# EAGLE design Yantronix_ECG_Pre_Alpha (EAGLE 5.10)
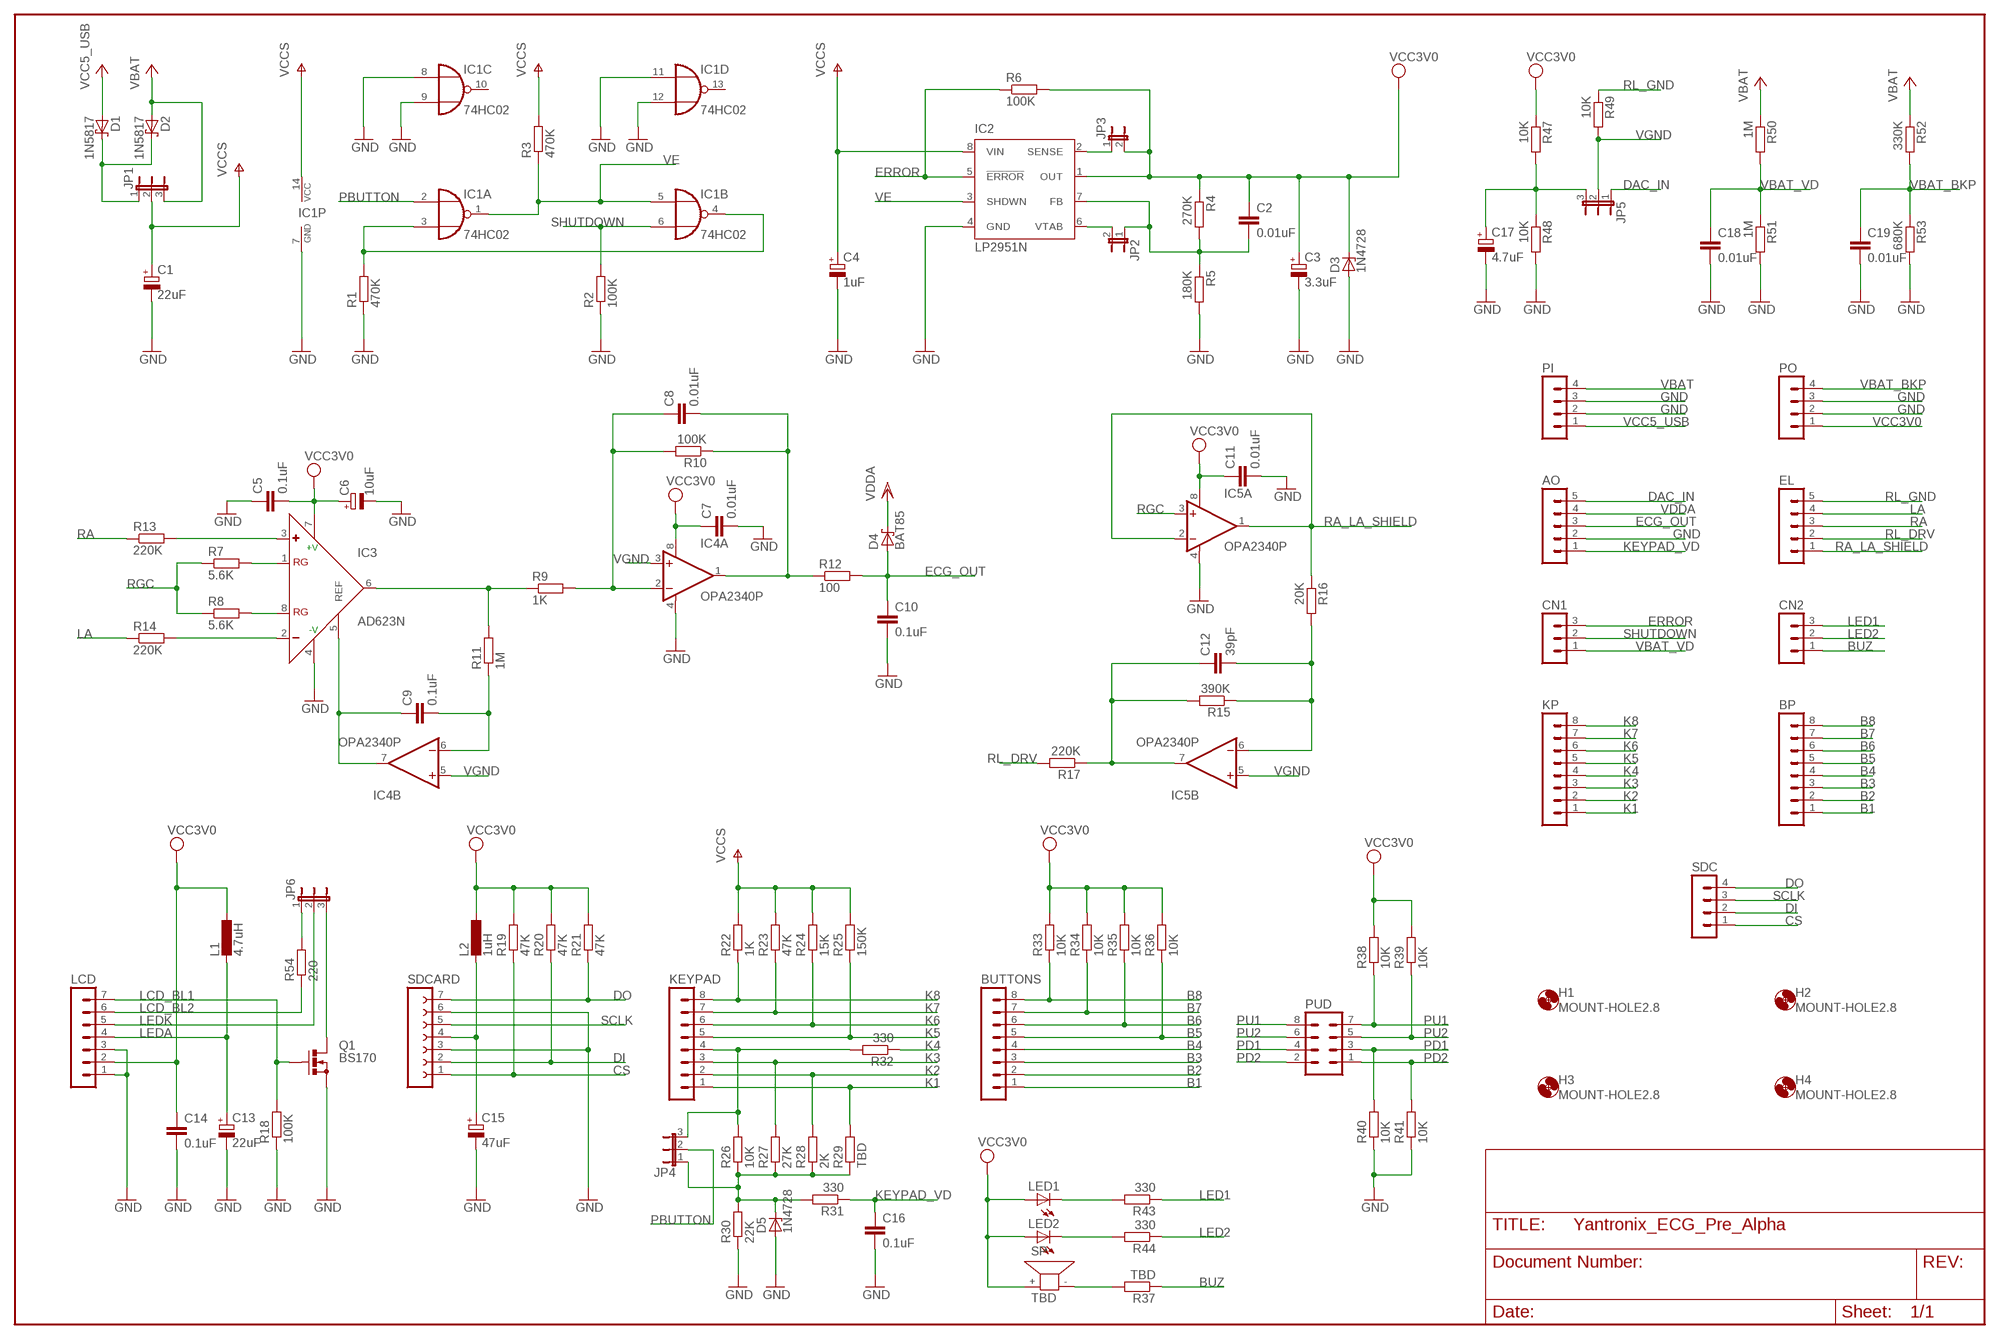
[diagram p0: schematic, sheet 1]

## Parts
AO  MA05-1  [MA05-1]
BP  MA08-1  [MA08-1]
BUTTONS  MA08-1  [MA08-1]
C1  22uF  CPOL-EUE2.5-5  [E2,5-5]
C2  0.01uF  C-EU050-025X075  [C050-025X075]
C3  3.3uF  CPOL-EUE2.5-5  [E2,5-5]
C4  1uF  CPOL-EUE2.5-5  [E2,5-5]
C5  0.1uF  C-EU050-025X075  [C050-025X075]
C6  10uF  CPOL-EUE2.5-5  [E2,5-5]
C7  0.01uF  C-EU050-025X075  [C050-025X075]
C8  0.01uF  C-EU050-025X075  [C050-025X075]
C9  0.1uF  C-EU050-025X075  [C050-025X075]
C10  0.1uF  C-EU050-025X075  [C050-025X075]
C11  0.01uF  C-EU050-025X075  [C050-025X075]
C12  39pF  C-EU050-025X075  [C050-025X075]
C13  22uF  CPOL-EUE2.5-5  [E2,5-5]
C14  0.1uF  C-EU050-025X075  [C050-025X075]
C15  47uF  CPOL-EUE2.5-5  [E2,5-5]
C16  0.1uF  C-EU050-025X075  [C050-025X075]
C17  4.7uF  CPOL-EUE2.5-5  [E2,5-5]
C18  0.01uF  C-EU050-025X075  [C050-025X075]
C19  0.01uF  C-EU050-025X075  [C050-025X075]
CN1  MA03-1  [MA03-1]
CN2  MA03-1  [MA03-1]
D1  1N5817  1N5817-B  [DO41-7.6]
D2  1N5817  1N5817-B  [DO41-7.6]
D3  1N4728  [DO41Z10]
D4  BAT85  SCHOTTKY-DIODEDO35-7  [DO35-7]
D5  1N4728  [DO41Z10]
EL  MA05-1  [MA05-1]
H1  MOUNT-HOLE2.8  [2,8]
H2  MOUNT-HOLE2.8  [2,8]
H3  MOUNT-HOLE2.8  [2,8]
H4  MOUNT-HOLE2.8  [2,8]
IC1  74HC02  74HC02N  [DIL14]
IC2  LP2951N  [DIL08]
IC3  AD623N  [DIL08]
IC4  OPA2340P  [DIL08]
IC5  OPA2340P  [DIL08]
JP1  JP2E  [JP2]
JP2  JP1E  [JP1]
JP3  JP1E  [JP1]
JP4  JP2E  [JP2]
JP5  JP2E  [JP2]
JP6  JP2E  [JP2]
KEYPAD  MA08-1  [MA08-1]
KP  MA08-1  [MA08-1]
L1  4.7uH  L-EU2200-15.24  [2200-15.24]
L2  1uH  L-EU2200-15.24  [2200-15.24]
LCD  MA07-1  [MA07-1]
LED1  LED3MM  [LED3MM]
LED2  LED3MM  [LED3MM]
PI  MA04-1  [MA04-1]
PO  MA04-1  [MA04-1]
PUD  MA04-2  [MA04-2]
Q1  BS170  [SOT54E]
R1  470K  R-EU_0204/7  [0204/7]
R2  100K  R-EU_0204/7  [0204/7]
R3  470K  R-EU_0204/7  [0204/7]
R4  270K  R-EU_0204/7  [0204/7]
R5  180K  R-EU_0204/7  [0204/7]
R6  100K  R-EU_0204/7  [0204/7]
R7  5.6K  R-EU_0204/7  [0204/7]
R8  5.6K  R-EU_0204/7  [0204/7]
R9  1K  R-EU_0204/7  [0204/7]
R10  100K  R-EU_0204/7  [0204/7]
R11  1M  R-EU_0204/7  [0204/7]
R12  100  R-EU_0204/7  [0204/7]
R13  220K  R-EU_0204/7  [0204/7]
R14  220K  R-EU_0204/7  [0204/7]
R15  390K  R-EU_0204/7  [0204/7]
R16  20K  R-EU_0204/7  [0204/7]
R17  220K  R-EU_0204/7  [0204/7]
R18  100K  R-EU_0204/7  [0204/7]
R19  47K  R-EU_0204/7  [0204/7]
R20  47K  R-EU_0204/7  [0204/7]
R21  47K  R-EU_0204/7  [0204/7]
R22  1K  R-EU_0204/7  [0204/7]
R23  47K  R-EU_0204/7  [0204/7]
R24  15K  R-EU_0204/7  [0204/7]
R25  150K  R-EU_0204/7  [0204/7]
R26  10K  R-EU_0204/7  [0204/7]
R27  27K  R-EU_0204/7  [0204/7]
R28  2K  R-EU_0204/7  [0204/7]
R29  TBD  R-EU_0204/7  [0204/7]
R30  22K  R-EU_0204/7  [0204/7]
R31  330  R-EU_0204/7  [0204/7]
R32  330  R-EU_0204/7  [0204/7]
R33  10K  R-EU_0204/7  [0204/7]
R34  10K  R-EU_0204/7  [0204/7]
R35  10K  R-EU_0204/7  [0204/7]
R36  10K  R-EU_0204/7  [0204/7]
R37  TBD  R-EU_0204/7  [0204/7]
R38  10K  R-EU_0204/7  [0204/7]
R39  10K  R-EU_0204/7  [0204/7]
R40  10K  R-EU_0204/7  [0204/7]
R41  10K  R-EU_0204/7  [0204/7]
R43  330  R-EU_0204/7  [0204/7]
R44  330  R-EU_0204/7  [0204/7]
R47  10K  R-EU_0204/7  [0204/7]
R48  10K  R-EU_0204/7  [0204/7]
R49  10K  R-EU_0204/7  [0204/7]
R50  1M  R-EU_0204/7  [0204/7]
R51  1M  R-EU_0204/7  [0204/7]
R52  330K  R-EU_0204/7  [0204/7]
R53  680K  R-EU_0204/7  [0204/7]
R54  220  R-EU_0204/7  [0204/7]
SDC  MA04-1  [MA04-1]
SDCARD  FE07W  [FE07W]
SP  TBD  KSS1201  [KSS1201]

## Nets
B1: BP.1 BUTTONS.1
B2: BP.2 BUTTONS.2
B3: BP.3 BUTTONS.3
B4: BP.4 BUTTONS.4
B5: BP.5 BUTTONS.5 R36.1
B6: BP.6 BUTTONS.6 R35.1
B7: BP.7 BUTTONS.7 R34.1
B8: BP.8 BUTTONS.8 R33.1
BUZ: CN2.1 R37.1
CS: R19.1 SDC.1 SDCARD.1
DAC_IN: AO.5 JP5.1
DI: R20.1 SDC.2 SDCARD.2
DO: R21.1 SDC.4 SDCARD.7
ECG_OUT: AO.3 C10.1 D4.A R12.2
ERROR: CN1.3 IC2.5(!ERROR) R6.1
GND: AO.2 C1.- C3.- C4.- C5.1 C6.- C7.2 C10.2 C11.2 C13.- C14.2 C15.- C16.2 C17.- C18.2 C19.2 D3.A D5.A IC1.7(P:GND) IC1.8(C:I0) IC1.9(C:I1) IC1.11(D:I0) IC1.12(D:I1) IC2.4(GND) IC3.4(-V) IC4.4(A:V-) IC5.4(A:V-) LCD.1 LCD.3 PI.2 PI.3 PO.2 PO.3 Q1.S R1.1 R2.1 R5.2 R18.1 R30.1 R40.1 R41.1 R48.2 R51.2 R53.2 SDCARD.3 SDCARD.6
K1: KEYPAD.1 KP.1 R29.2
K2: KEYPAD.2 KP.2 R28.2
K3: KEYPAD.3 KP.3 R27.2
K4: KP.4 R32.1
K5: KEYPAD.5 KP.5 R25.1
K6: KEYPAD.6 KP.6 R24.1
K7: KEYPAD.7 KP.7 R23.1
K8: KEYPAD.8 KP.8 R22.1
KEYPAD_VD: AO.1 C16.1 R31.1
LA: EL.4 R14.1
LCD_BL1: LCD.7 Q1.G R18.2
LCD_BL2: LCD.6 R54.1
LED1: CN2.3 R43.1
LED2: CN2.2 R44.1
LEDA: C13.+ L1.2 LCD.4
LEDK: JP6.2 LCD.5
N$1: D1.C D2.C JP1.1
N$3: IC1.3(A:I1) IC1.4(B:O) R1.2
N$4: IC2.6(VTAB) JP2.2
N$5: C2.2 IC2.7(FB) JP2.1 R4.2 R5.1
N$6: IC2.2(SENSE) JP3.1
N$7: IC3.1(RG) R7.2
N$8: IC3.8(RG) R8.2
N$9: C12.2 IC5.6(B:-IN) R15.1 R16.2
N$10: IC3.6(OUT) R9.1 R11.2
N$11: C8.1 IC4.2(A:-IN) R9.2 R10.2
N$12: C8.2 IC4.1(A:OUT) R10.1 R12.1
N$13: C12.1 IC5.7(B:OUT) R15.2 R17.1
N$14: C9.2 IC4.6(B:-IN) R11.1
N$15: C9.1 IC3.5(REF) IC4.7(B:OUT)
N$16: LED1.K(C) R43.2
N$17: IC3.3(+) R13.2
N$18: IC3.2(-) R14.2
N$19: LED2.K(C) R44.2
N$20: R37.2 SP.-
N$21: C15.+ L2.2 SDCARD.4
N$24: C17.+ JP5.3 R47.2 R48.1
N$27: JP4.3 KEYPAD.4 R26.2 R32.2
N$28: D5.C JP4.1 R26.1 R27.1 R28.1 R29.1 R30.2 R31.2
N$29: JP6.3 Q1.D
N$32: JP6.1 R54.2
PBUTTON: IC1.2(A:I0) JP4.2
PD1: PUD.3 PUD.4 R40.2
PD2: PUD.1 PUD.2 R41.2
PU1: PUD.7 PUD.8 R38.1
PU2: PUD.5 PUD.6 R39.1
RA: EL.3 R13.1
RA_LA_SHIELD: EL.1 IC5.1(A:OUT) IC5.2(A:-IN) R16.1
RGC: IC5.3(A:+IN) R7.1 R8.1
RL_DRV: EL.2 R17.2
RL_GND: EL.5 R49.1
SCLK: SDC.3 SDCARD.5
SHUTDOWN: CN1.2 IC1.6(B:I1) R2.2
VBAT [supply]: D2.A JP1.3 PI.4 R50.1 R52.1
VBAT_BKP: C19.1 PO.4 R52.2 R53.1
VBAT_VD: C18.1 CN1.1 R50.2 R51.1
VCC3V0 [supply]: C2.1 C3.+ C5.2 C6.+ C7.1 C11.1 C14.1 D3.C IC2.1(OUT) IC3.7(+V) IC4.8(A:V+) IC5.8(A:V+) JP3.2 L1.1 L2.1 LCD.2 LED1.A LED2.A PO.1 R4.1 R6.2 R19.2 R20.2 R21.2 R33.2 R34.2 R35.2 R36.2 R38.2 R39.2 R47.1 SP.+
VCC5_USB [supply]: D1.A PI.1
VCCS [supply]: C1.+ C4.+ IC1.14(P:VCC) IC2.8(VIN) JP1.2 R3.2 R22.2 R23.2 R24.2 R25.2
VDDA [supply]: AO.4 D4.C
VE: IC1.1(A:O) IC1.5(B:I0) IC2.3(SHDWN) R3.1
VGND: IC4.3(A:+IN) IC4.5(B:+IN) IC5.5(B:+IN) JP5.2 R49.2
Unconnected: IC1.10(C:O) IC1.13(D:O)

## Library data of the parts
AO EL = con-lstb:MA05-1: PIN HEADER
BP BUTTONS KEYPAD KP = con-lstb:MA08-1: PIN HEADER
C1 C3 C4 C6 C13 C15 C17 = rcl:CPOL-EU: POLARIZED CAPACITOR, European symbol
C2 C5 C7-C12 C14 C16 C18 C19 = rcl:C-EU: CAPACITOR, European symbol
CN1 CN2 = con-lstb:MA03-1: PIN HEADER
D1 D2 = diode:1N581*: 1.0A SCHOTTKY BARRIER RECTIFIER Source: http://www.diodes.com/datasheets/ds23001.pdf
D3 D5 = diode:1N4728: Z DIODE 3.3 V, 1W, 5 percent
D4 = diode:SCHOTTKY-DIODE: Schottky Diode
H1-H4 = holes:MOUNT-HOLE: MOUNTING HOLE with drill center marker
IC1 = 74xx-eu:74*02: Quad 2-input NOR gate
IC2 = national-semiconductor:LP2951: Adjustable Micropower Voltage Regulator Source: http://www.national.com/ds/LP/LP2950.pdf
IC3 = analog-devices:AD623: Single-Supply, Rail-to-Rail, Low Cost Instrumentation Amplifier Source: http://www.analog.com/static/imported-files/data_sheets/AD623.pdf
IC4 IC5 = burr-brown:OPA2340: Single-Supply, Rail-to-Rail Operational Amplifiers MicroAmplifier(TM) Series; Product Folder:OPA2340
JP1 JP4-JP6 = jumper:JP2E: JUMPER
JP2 JP3 = jumper:JP1E: JUMPER
L1 L2 = rcl:L-EU: INDUCTOR, European symbol
LCD = con-lstb:MA07-1: PIN HEADER
LED1 LED2 = led:LED: LED OSRAM: - CHIPLED LG R971, LG N971, LY N971, LG Q971, LY Q971, LO R971, LY R971 LH N974, LH R974 LS Q976, LO Q976, LY Q976 LO Q996 - Hyper CHIPLED LW Q18S LB Q993, LB Q99A, LB R99A - SideLED LS A670, LO A670, LY A670, LG A670, LP A670 LB A673, LV A673, LT A673, LW A673 LH A674 LY A675 LS A676, LA A676, LO A676, LY A676, LW A676 LS A679, LY A679, LG A679 - Hyper Micro SIDELED® LS Y876, LA Y876, LO Y876, LY Y876 LT Y87S - SmartLED LW L88C, LW L88S LB L89C, LB L89S, LG L890 LS L89K, LO L89K, LY L89K LS L896, LA L896, LO L896, LY L896 - TOPLED LS T670, LO T670, LY T670, LG T670, LP T670 LSG T670, LSP T670, LSY T670, LOP T670, LYG T670 LG T671, LOG T671, LSG T671 LB T673, LV T673, LT T673, LW T673 LH T674 LS T676, LA T676, LO T676, LY T676, LB T676, LH T676, LSB T676, LW T676 LB T67C, LV T67C, LT T67C, LS T67K, LO T67K, LY T67K, LW E67C LS E67B, LA E67B, LO E67B, LY E67B, LB E67C, LV E67C, LT E67C LW T67C LS T679, LY T679, LG T679 LS T770, LO T770, LY T770, LG T770, LP T770 LB T773, LV T773, LT T773, LW T773 LH T774 LS E675, LA E675, LY E675, LS T675 LS T776, LA T776, LO T776, LY T776, LB T776 LHGB T686 LT T68C, LB T68C - Hyper Mini TOPLED® LB M676 - Mini TOPLED Santana® LG M470 LS M47K, LO M47K, LY M47K Source: http://www.osram.convergy.de LUXEON: - LUMILED® LXK2-PW12-R00, LXK2-PW12-S00, LXK2-PW14-U00, LXK2-PW14-V00 LXK2-PM12-R00, LXK2-PM12-S00, LXK2-PM14-U00 LXK2-PE12-Q00, LXK2-PE12-R00, LXK2-PE12-S00, LXK2-PE14-T00, LXK2-PE14-U00 LXK2-PB12-K00, LXK2-PB12-L00, LXK2-PB12-M00, LXK2-PB14-N00, LXK2-PB14-P00, LXK2-PB14-Q00 LXK2-PR12-L00, LXK2-PR12-M00, LXK2-PR14-Q00, LXK2-PR14-R00 LXK2-PD12-Q00, LXK2-PD12-R00, LXK2-PD12-S00 LXK2-PH12-R00, LXK2-PH12-S00 LXK2-PL12-P00, LXK2-PL12-Q00, LXK2-PL12-R00 Source: www.luxeon.com KINGBRIGHT: KA-3528ASYC Source: www.kingbright.com
PI PO SDC = con-lstb:MA04-1: PIN HEADER
PUD = con-lstb:MA04-2: PIN HEADER
Q1 = transistor-small-signal:BS170: N-CHANNEL MOS FET
R1-R41 R43 R44 R47-R54 = rcl:R-EU_: RESISTOR, European symbol
SDCARD = con-lsta:FE07W: FEMALE HEADER
SP = buzzer:KSS1201: SPEAKER Source: Schukat

## Net classes
1 supply: width 1.27 mm

## Board
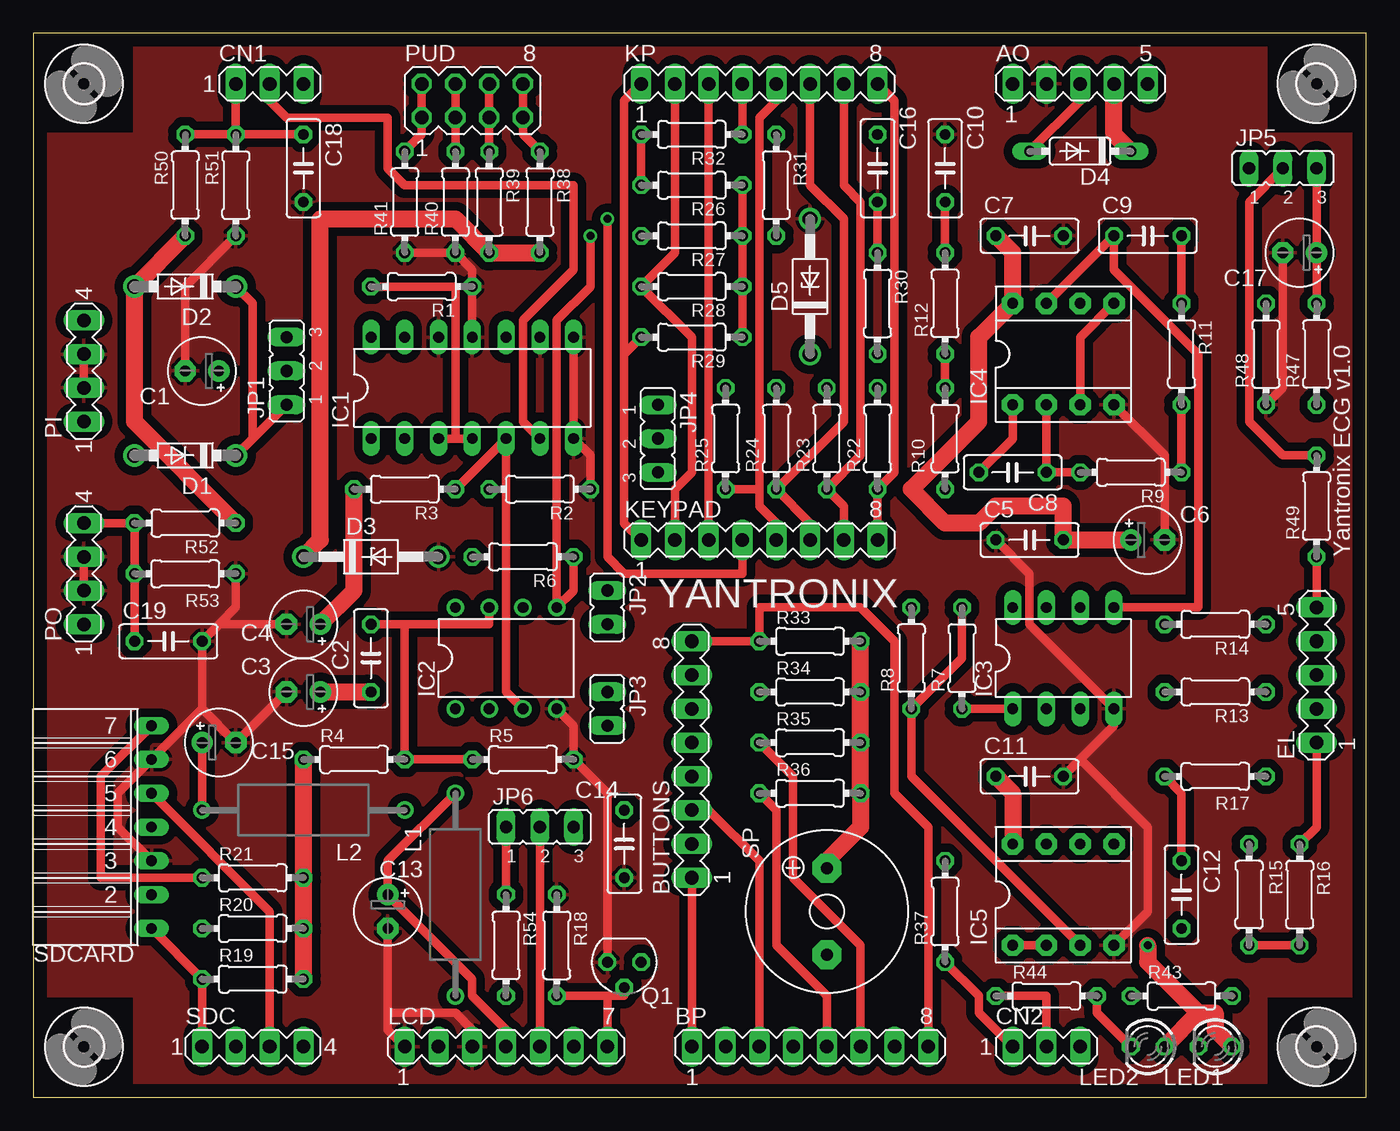
[diagram p1: board, top side]
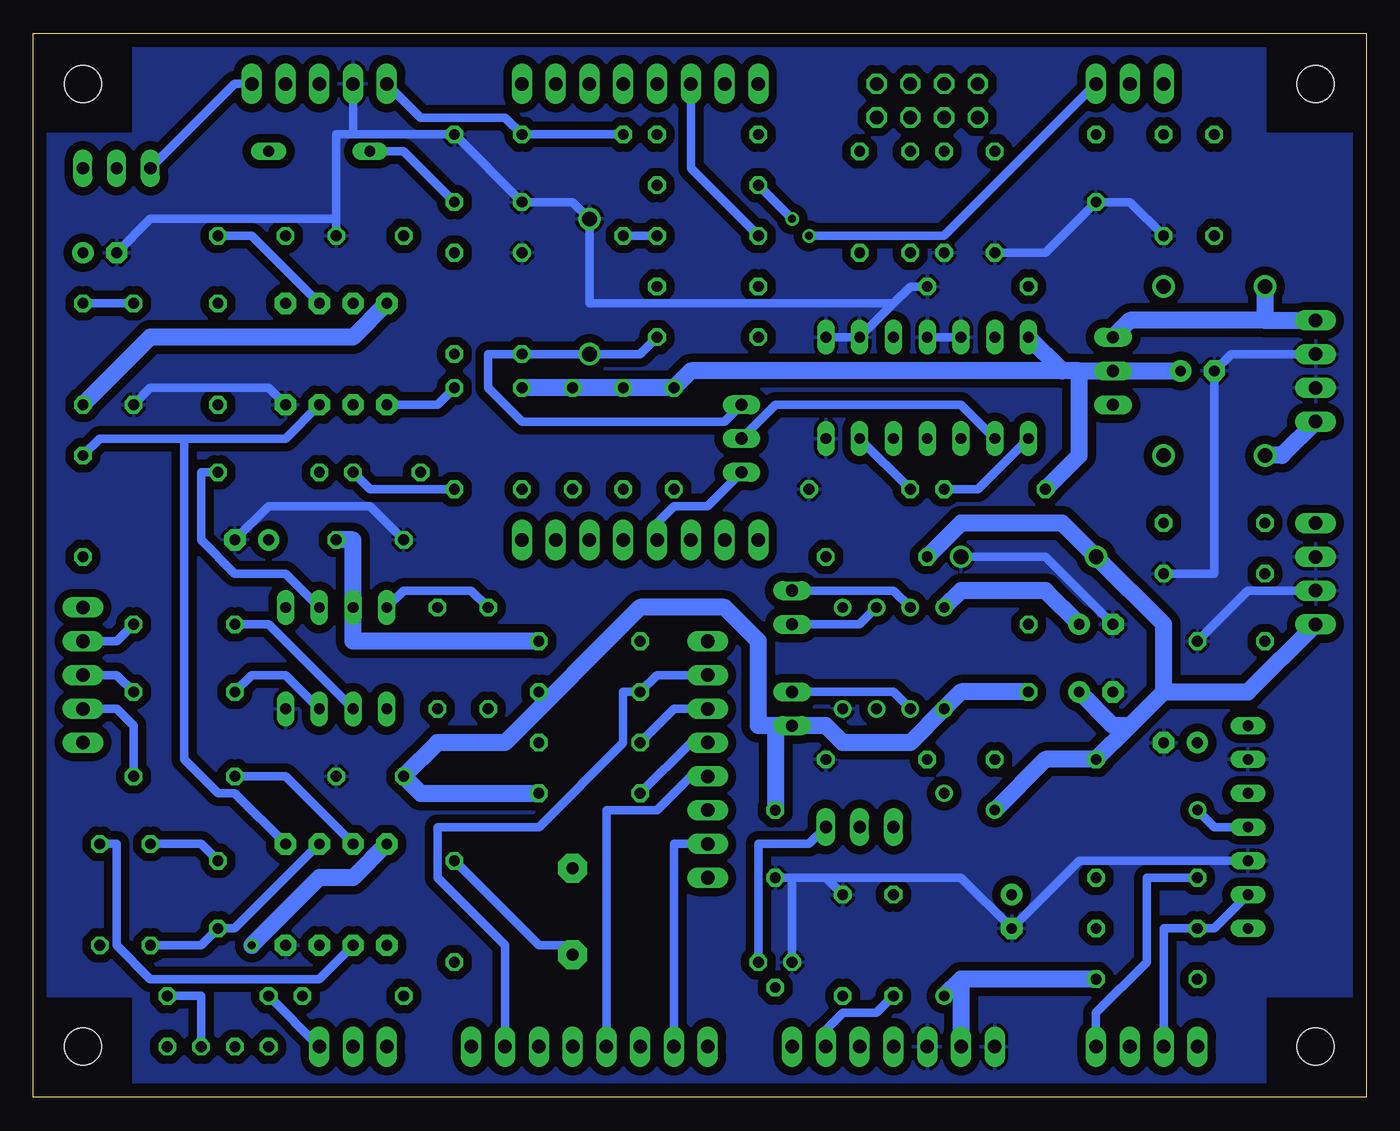
[diagram p2: board, bottom side, seen from below]

Size 100.25 x 80 mm. Coordinates in mm from the lower left corner, seen from the top.
Outline: 0,0 100.25,0 100.25,80 0,80 0,0
Copper layers (1*16): Top 0.035mm / dielectric 1.5mm / Bottom 0.035mm
Design rules "default *": minimum track width 25mil, minimum drill 24mil, track to track 25mil, track to pad 10mil, pad to pad 10mil, via to via 10mil, smd to smd 8mil, copper to edge 40mil, drill to drill 8mil, minimum pad ring 10mil, minimum via ring 8mil, stop-mask expansion 4mil, vias tented up to drill 0mil, thermal gap 10mil

### Footprints (pad centres in the part's own frame; a part is rotated, then mirrored left to right if it is on the bottom)
MA05-1 = drill 1.016 long: 1 -5.08,0; 2 -2.54,0; 3 0,0; 4 2.54,0; 5 5.08,0
MA08-1 = drill 1.016 long: 1 -8.89,0; 2 -6.35,0; 3 -3.81,0; 4 -1.27,0; 5 1.27,0; 6 3.81,0; 7 6.35,0; 8 8.89,0
E2,5-5 = drill 0.813 pad 1.6 round: + -1.27,0 | drill 0.813 pad 1.6 octagon: - 1.27,0
C050-025X075 = drill 0.813 octagon: 1 -2.54,0; 2 2.54,0
MA03-1 = drill 1.016 long: 1 -2.54,0; 2 0,0; 3 2.54,0
DO41-7.6 = drill 1.1 pad 1.7 round: A 3.81,0; C -3.81,0
DO41Z10 = drill 1.118 round: A 5.08,0; C -5.08,0
DO35-7 = drill 0.813 long: A 3.81,0; C -3.81,0
2,8 = hole 2.8: 0,0
DIL14 = drill 0.813 long: 1 -7.62,-3.81; 2 -5.08,-3.81; 3 -2.54,-3.81; 4 0,-3.81; 5 2.54,-3.81; 6 5.08,-3.81; 7 7.62,-3.81; 8 7.62,3.81; 9 5.08,3.81; 10 2.54,3.81; 11 0,3.81; 12 -2.54,3.81; 13 -5.08,3.81; 14 -7.62,3.81
DIL08 = drill 0.813 pad 1.27 round: 1 -3.81,-3.81; 2 -1.27,-3.81; 3 1.27,-3.81; 4 3.81,-3.81; 5 3.81,3.81; 6 1.27,3.81; 7 -1.27,3.81; 8 -3.81,3.81
DIL08' = drill 0.813 long: 1 -3.81,-3.81; 2 -1.27,-3.81; 3 1.27,-3.81; 4 3.81,-3.81; 5 3.81,3.81; 6 1.27,3.81; 7 -1.27,3.81; 8 -3.81,3.81
DIL08'' = drill 0.813 pad 1.6 octagon: 1 -3.81,-3.81; 2 -1.27,-3.81; 3 1.27,-3.81; 4 3.81,-3.81; 5 3.81,3.81; 6 1.27,3.81; 7 -1.27,3.81; 8 -3.81,3.81
JP2 = drill 0.914 long: 1 -2.54,0; 2 0,0; 3 2.54,0
JP1 = drill 0.914 long: 1 0,-1.27; 2 0,1.27
2200-15.24 = drill 0.8 pad 1.27 round: 1 -7.62,0; 2 7.62,0
MA07-1 = drill 1.016 long: 1 -7.62,0; 2 -5.08,0; 3 -2.54,0; 4 0,0; 5 2.54,0; 6 5.08,0; 7 7.62,0
LED3MM = drill 0.813 octagon: A -1.27,0; K 1.27,0
MA04-1 = drill 1.016 long: 1 -3.81,0; 2 -1.27,0; 3 1.27,0; 4 3.81,0
MA04-2 = drill 1.016 octagon: 1 -3.81,-1.27; 2 -3.81,1.27; 3 -1.27,-1.27; 4 -1.27,1.27; 5 1.27,-1.27; 6 1.27,1.27; 7 3.81,-1.27; 8 3.81,1.27
SOT54E = drill 0.813 octagon: D -1.27,0; G 0,1.905; S 1.27,0
0204/7 = drill 0.813 octagon: 1 -3.81,0; 2 3.81,0
FE07W = drill 0.813 long: 1 -7.62,0; 2 -5.08,0; 3 -2.54,0; 4 0,0; 5 2.54,0; 6 5.08,0; 7 7.62,0
KSS1201 = drill 0.914 pad 2.159 octagon: + 3.251,0; - -3.251,0

### Placement (x,y rotation side)
AO  78.74,76.2 0 top
BP  58.42,3.81 0 top
BUTTONS  49.53,25.4 90 top
C1  12.7,54.61 180 top
C2  25.4,33.02 90 top
C3  20.32,30.48 180 top
C4  20.32,35.56 180 top
C5  74.93,41.91 0 top
C6  83.82,41.91 0 top
C7  74.93,64.77 0 top
C8  73.66,46.99 180 top
C9  83.82,64.77 0 top
C10  68.58,69.85 90 top
C11  74.93,24.13 0 top
C12  86.36,15.24 270 top
C13  26.67,13.97 270 top
C14  44.45,19.05 270 top
C15  13.97,26.67 0 top
C16  63.5,69.85 270 top
C17  95.25,63.5 180 top
C18  20.32,69.85 270 top
C19  10.16,34.29 0 top
CN1  17.78,76.2 0 top
CN2  76.2,3.81 0 top
D1  11.43,48.26 180 top
D2  11.43,60.96 180 top
D3  25.4,40.64 0 top
D4  78.74,71.12 180 top
D5  58.42,60.96 90 top
EL  96.52,31.75 90 top
H1  3.81,3.81 0 top
H2  96.52,3.81 0 top
H3  96.52,76.2 0 top
H4  3.81,76.2 0 top
IC1  33.02,53.34 0 top
IC2  35.56,33.02 0 top
IC3  AD623N  [DIL08']  77.47,33.02 0 top
IC4  OPA2340P  [DIL08'']  77.47,55.88 0 top
IC5  OPA2340P  [DIL08'']  77.47,15.24 0 top
JP1  19.05,54.61 90 top
JP2  43.18,36.83 180 top
JP3  43.18,29.21 180 top
JP4  46.99,49.53 270 top
JP5  93.98,69.85 0 top
JP6  38.1,20.32 0 top
KEYPAD  54.61,41.91 0 top
KP  54.61,76.2 0 top
L1  31.75,15.24 90 top
L2  20.32,21.59 180 top
LCD  35.56,3.81 0 top
LED1  88.9,3.81 180 top
LED2  83.82,3.81 180 top
PI  3.81,54.61 90 top
PO  3.81,39.37 90 top
PUD  33.02,74.93 0 top
Q1  44.45,10.16 180 top
R1  29.21,60.96 180 top
R2  38.1,45.72 180 top
R3  27.94,45.72 180 top
R4  24.13,25.4 0 top
R5  36.83,25.4 0 top
R6  36.83,40.64 180 top
R7  69.85,33.02 270 top
R8  66.04,33.02 90 top
R9  82.55,46.99 180 top
R10  68.58,49.53 270 top
R11  86.36,55.88 270 top
R12  68.58,59.69 90 top
R13  88.9,30.48 180 top
R14  88.9,35.56 180 top
R15  91.44,15.24 90 top
R16  95.25,15.24 270 top
R17  88.9,24.13 0 top
R18  39.37,11.43 270 top
R19  16.51,8.89 0 top
R20  16.51,12.7 0 top
R21  16.51,16.51 0 top
R22  63.5,49.53 90 top
R23  59.69,49.53 90 top
R24  55.88,49.53 90 top
R25  52.07,49.53 90 top
R26  49.53,68.58 180 top
R27  49.53,64.77 180 top
R28  49.53,60.96 180 top
R29  49.53,57.15 180 top
R30  63.5,59.69 270 top
R31  55.88,68.58 270 top
R32  49.53,72.39 180 top
R33  58.42,34.29 0 top
R34  58.42,30.48 0 top
R35  58.42,26.67 0 top
R36  58.42,22.86 0 top
R37  68.58,13.97 90 top
R38  38.1,67.31 270 top
R39  34.29,67.31 270 top
R40  31.75,67.31 90 top
R41  27.94,67.31 90 top
R43  86.36,7.62 0 top
R44  76.2,7.62 0 top
R47  96.52,55.88 90 top
R48  92.71,55.88 270 top
R49  96.52,44.45 90 top
R50  11.43,68.58 90 top
R51  15.24,68.58 270 top
R52  11.43,43.18 180 top
R53  11.43,39.37 0 top
R54  35.56,11.43 90 top
SDC  16.51,3.81 0 top
SDCARD  8.89,20.32 90 top
SP  59.69,13.97 90 top

### Tracks (layer width: path | path; a pad name or v marks a point on that pad's centre or on a via)
B1
  Top 0.635: BP.1 BUTTONS.1
B2
  Bottom 0.635: BP.2 52.07,19.05 BUTTONS.2
B3
  Top 0.635: BP.3 54.61,17.78 50.8,21.59 BUTTONS.3
B4
  Bottom 0.635: BP.4 57.15,21.59 53.34,21.59 50.8,24.13 BUTTONS.4
B5
  Top 0.635: BP.5 59.69,7.62 55.88,11.43 55.88,21.59 R36.1
  Bottom 0.635: R36.1 50.8,26.67 BUTTONS.5
B6
  Top 0.635: BP.6 62.23,11.43 57.15,16.51 57.15,24.13 R35.1
  Bottom 0.635: R35.1 52.07,29.21 BUTTONS.6
B7
  Bottom 0.635: BUTTONS.7 53.34,31.75 R34.1 55.88,30.48 55.88,26.67 62.23,20.32 69.85,20.32 69.85,16.51 64.77,11.43 BP.7
B8
  Top 0.635: BUTTONS.8 R33.1 54.61,36.83 62.23,36.83 64.77,34.29 64.77,22.86 67.31,20.32 BP.8
BUZ
  Top 0.635: R37.1 71.12,7.62 71.12,6.35 CN2.1
CS
  Top 0.635: SDC.1 R19.1 SDCARD.1
DAC_IN
  Bottom 0.635: JP5.1 85.09,76.2 AO.5
DI
  Bottom 0.635: SDCARD.2 11.43,12.7 R20.1 15.24,12.7 SDC.2
DO
  Top 0.635: R21.1 5.08,16.51 5.08,24.13 SDCARD.7
  Bottom 0.635: SDC.4 20.32,6.35 16.51,10.16 16.51,16.51 R21.1
ECG_OUT
  Top 0.635: R12.2 C10.1 | D4.A 78.74,74.93 AO.3
  Bottom 0.635: C10.1 72.39,71.12 D4.A
ERROR  (via drill 0.61)
  Top 0.635: R6.1 40.64,38.1 IC2.5 39.37,58.42 41.91,60.96 v41.91,64.77
  Bottom 0.635: CN1.3 31.75,64.77 v41.91,64.77
GND
  Top 0.635: 78.74,25.4 81.28,27.94 IC3.4 74.93,35.56 74.93,39.37 C5.1 | 78.74,25.4 C11.2 | IC5.4 83.82,13.97 83.82,20.32 78.74,25.4 | IC4.4 85.09,48.26 C6.- | R48.2 93.98,53.34 C17.- | C16.2 R30.1 | R2.1 41.91,48.26 IC1.7 IC1.8 | R41.1 R40.1 33.02,62.23 R1.1 IC1.11 | LCD.1 26.67,5.08 26.67,6.35 | C13.- 26.67,6.35 | LCD.3 33.02,5.08 31.75,6.35 26.67,6.35 | IC2.4 40.64,27.94 R5.2 43.18,22.86 Q1.S | PI.3 PI.2 | C3.- C15.- 12.7,29.21 | SDCARD.3 6.35,20.32 6.35,22.86 SDCARD.6 12.7,29.21 | PO.2 PO.3 | 13.97,35.56 15.24,36.83 R53.2 | 13.97,35.56 C19.2 12.7,29.21 | 13.97,35.56 C4.- | R51.2 11.43,60.96 C1.-
  Bottom 0.635: C5.1 74.93,44.45 82.55,44.45 C6.- | 77.47,66.04 77.47,72.39 76.2,72.39 | 77.47,66.04 C7.2 | 76.2,72.39 C10.2 C16.2 59.69,67.31 D5.A 58.42,59.69 35.56,59.69 | 76.2,72.39 AO.2 | C17.- 91.44,66.04 77.47,66.04 | IC4.4 82.55,53.34 91.44,53.34 R48.2 | R51.2 17.78,67.31 C18.2 24.13,63.5 R41.1 | IC1.8 IC1.9 35.56,59.69 | IC1.11 IC1.12 | 35.56,59.69 34.29,60.96 R1.1 | 40.64,16.51 R18.1 | 43.18,16.51 C14.2 | 40.64,16.51 43.18,16.51 | 43.18,16.51 Q1.S | 40.64,16.51 30.48,16.51 C13.- 21.59,17.78 SDCARD.3 | PI.3 10.16,55.88 C1.- 11.43,39.37 R53.2 | D3.A 24.13,40.64 C4.- | PO.2 8.89,38.1 C19.2
  pour Bottom: 0,7.62 7.62,7.62 7.62,0 92.71,0 92.71,7.62 100.33,7.62 100.33,72.39 92.71,72.39 92.71,80.01 7.62,80.01 7.62,78.74 7.62,72.39 0,72.39
  pour Top: 0,7.62 7.62,7.62 7.62,0 92.71,0 92.71,7.62 100.33,7.62 100.33,72.39 92.71,72.39 92.71,80.01 7.62,80.01 7.62,72.39 0,72.39
K1
  Top 0.635: 44.45,55.88 R29.2 | 44.45,55.88 44.45,43.18 KEYPAD.1 | KP.1 44.45,74.93 44.45,55.88
K2
  Top 0.635: KP.2 48.26,63.5 R28.2 49.53,57.15 49.53,46.99 48.26,45.72 KEYPAD.2
K3
  Top 0.635: KEYPAD.3 KP.3
  Bottom 0.635: R27.2 50.8,69.85 KP.3
K4
  Top 0.635: R32.1 KP.4
K5
  Top 0.635: R25.1 54.61,45.72 | 54.61,45.72 54.61,44.45 55.88,43.18 KEYPAD.5 | KP.5 55.88,74.93 54.61,73.66 54.61,45.72
K6
  Top 0.635: KEYPAD.6 58.42,43.18 R24.1 60.96,50.8 60.96,66.04 58.42,68.58 KP.6
K7
  Top 0.635: KEYPAD.7 60.96,44.45 R23.1 62.23,48.26 62.23,67.31 60.96,68.58 KP.7
K8
  Top 0.635: KEYPAD.8 R22.1 64.77,46.99 64.77,74.93 KP.8
KEYPAD_VD
  Bottom 0.635: R31.1 C16.1 64.77,73.66 71.12,73.66 AO.1
LA
  Bottom 0.635: R14.1 93.98,34.29 EL.4
LCD_BL1
  Top 0.635: 43.18,7.62 44.45,7.62 Q1.G | 43.18,7.62 R18.2 | LCD.7 43.18,7.62
LCD_BL2
  Bottom 0.635: R54.1 36.83,6.35 39.37,6.35 40.64,5.08 LCD.6
LED1
  Bottom 0.635: CN2.3 R43.1
LED2
  Top 0.635: R44.1 76.2,7.62 CN2.2
LEDA
  Top 0.635: L1.2 26.67,17.78 C13.+ 33.02,8.89 33.02,7.62 35.56,5.08 LCD.4
LEDK
  Top 0.635: LCD.5 JP6.2
N$1
  Top 0.635: D1.C 16.51,49.53 | 16.51,49.53 JP1.1 | D2.C 16.51,59.69 16.51,49.53
N$3
  Top 0.635: 31.75,49.53 IC1.4 | IC1.3 31.75,49.53 | R1.2 31.75,60.96 31.75,49.53
N$4
  Bottom 0.635: IC2.6 38.1,35.56 JP2.2
N$5
  Top 0.635: R5.1 R4.2 27.94,35.56 | 27.94,35.56 34.29,35.56 IC2.7 | 27.94,35.56 C2.2
  Bottom 0.635: JP2.1 35.56,38.1 IC2.7
N$6
  Bottom 0.635: IC2.2 35.56,30.48 JP3.1
N$7
  Top 0.635: R7.2 IC3.1
N$8
  Bottom 0.635: R8.2 67.31,38.1 72.39,38.1 IC3.8
N$9
  Top 0.635: R15.1 R16.2
  Bottom 0.635: R15.1 87.63,11.43 C12.2 85.09,12.7 IC5.6
N$10
  Top 0.635: R9.1 R11.2
  Bottom 0.635: IC3.6 81.28,39.37 85.09,39.37 87.63,41.91 87.63,46.99 R9.1
N$11
  Top 0.635: R9.2 C8.1 IC4.2
  Bottom 0.635: R10.2 74.93,45.72 C8.1
N$12
  Top 0.635: R10.1 R12.1 | C8.2 73.66,49.53 IC4.1
  Bottom 0.635: R10.1 69.85,52.07 IC4.1
N$13
  Top 0.635: R17.1 86.36,22.86 C12.1
  Bottom 0.635: C12.1 87.63,19.05 R15.2 | IC5.7 81.28,24.13 R17.1
N$14
  Top 0.635: C9.2 R11.1
  Bottom 0.635: IC4.6 83.82,64.77 C9.2
N$15
  Top 0.635: IC3.5 87.63,36.83 87.63,55.88 81.28,62.23 C9.1 IC4.7
N$16
  Bottom 0.635: LED1.K 87.63,7.62 R43.2
N$17
  Bottom 0.635: IC3.3 81.28,31.75 83.82,31.75 R13.2
N$18
  Bottom 0.635: IC3.2 82.55,35.56 R14.2
N$19
  Top 0.635: LED2.K 80.01,6.35 R44.2
N$20
  Bottom 0.635: R37.2 62.23,11.43 59.69,11.43 SP.-
N$21
  Top 0.635: L2.2 C15.+
  Bottom 0.635: L2.2 11.43,20.32 SDCARD.4
N$24
  Top 0.635: JP5.3 C17.+ R47.2
  Bottom 0.635: R48.1 R47.2
N$27  (via drill 0.61)
  Top 0.635: R26.2 R32.2 | v43.18,66.04 43.18,40.64 44.45,39.37 53.34,39.37 KEYPAD.4
  Bottom 0.635: JP4.3 49.53,44.45 52.07,44.45 53.34,43.18 KEYPAD.4 | v43.18,66.04 R26.2
N$28
  Top 0.635: R29.1 R28.1 R27.1 R26.1
  Bottom 0.635: R27.1 R31.2 | JP4.1 48.26,50.8 63.5,50.8 66.04,53.34 66.04,55.88 R30.2 D5.C 54.61,55.88 R29.1
N$29
  Bottom 0.635: Q1.D 45.72,19.05 41.91,19.05 JP6.3
N$32
  Top 0.635: R54.2 JP6.1
PBUTTON
  Bottom 0.635: IC1.2 30.48,52.07 44.45,52.07 JP4.2
PD1
  Top 0.635: R40.2 PUD.3 PUD.4
PD2
  Top 0.635: R41.2 29.21,72.39 PUD.1 PUD.2
PU1
  Top 0.635: R38.1 36.83,72.39 PUD.7 PUD.8
PU2
  Top 0.635: R39.1 PUD.5 PUD.6
RA
  Bottom 0.635: R13.1 93.98,31.75 EL.3
RA_LA_SHIELD
  Top 0.635: IC5.1 IC5.2 | R16.1 96.52,20.32 EL.1
  Bottom 0.635: IC5.2 78.74,8.89 91.44,8.89 93.98,11.43 93.98,19.05 R16.1
RGC
  Top 0.635: R7.1 69.85,33.02 R8.1 66.04,24.13 IC5.3
RL_DRV
  Bottom 0.635: R17.2 92.71,27.94 93.98,29.21 EL.2
RL_GND
  Top 0.635: EL.5 R49.1
SCLK
  Top 0.635: SDCARD.5 17.78,13.97 SDC.3
SHUTDOWN
  Top 0.635: CN1.2 17.78,74.93 19.05,73.66 26.67,73.66 26.67,69.85 27.94,68.58 40.64,68.58 40.64,62.23 36.83,58.42 36.83,50.8 IC1.6
  Bottom 0.635: R2.2 IC1.6
VBAT
  Top 1.27: R52.1 7.62,50.8 D2.A R50.1
  Bottom 1.27: JP1.3 17.78,58.42 7.62,58.42 | 7.62,58.42 PI.4 | D2.A 7.62,58.42
VBAT_BKP
  Top 0.635: PO.4 R52.2 R53.1 C19.1
VBAT_VD
  Top 0.635: R50.2 R51.1 | R51.1 C18.1 | R51.1 CN1.1
VCC3V0  (via drill 0.61)
  Top 1.27: 87.63,6.35 LED2.A | 87.63,6.35 88.9,6.35 88.9,5.08 LED1.A | C11.1 73.66,22.86 IC5.8 | 87.63,6.35 83.82,10.16 v83.82,11.43 | C7.1 73.66,63.5 IC4.8 71.12,57.15 71.12,50.8 66.04,45.72 68.58,43.18 71.12,43.18 72.39,44.45 77.47,44.45 C5.2 C6.+ | R33.2 R34.2 R35.2 R36.2 62.23,20.32 59.69,17.78 SP.+ | R38.2 R39.2 31.75,66.04 21.59,66.04 21.59,41.91 D3.C | C3.+ C2.1 | R19.2 R20.2 R21.2 R4.1
  Bottom 1.27: v83.82,11.43 78.74,16.51 76.2,16.51 IC5.8 | R47.1 91.44,57.15 76.2,57.15 IC4.8 | C5.2 76.2,41.91 IC3.7 76.2,34.29 R33.2 | R36.2 71.12,22.86 C11.1 69.85,26.67 64.77,26.67 54.61,36.83 48.26,36.83 45.72,34.29 45.72,27.94 44.45,27.94 | R6.2 30.48,43.18 22.86,43.18 D3.C 15.24,35.56 15.24,30.48 | 44.45,27.94 C14.1 | C2.1 30.48,30.48 IC2.1 34.29,26.67 39.37,26.67 40.64,27.94 JP3.2 44.45,27.94 | 30.48,8.89 L1.1 | R19.2 30.48,8.89 | 30.48,8.89 LCD.2 | L2.1 24.13,25.4 R4.1 17.78,27.94 | PO.1 8.89,30.48 15.24,30.48 | 17.78,27.94 15.24,30.48 | C3.+ 19.05,27.94 17.78,27.94
VCC5_USB
  Bottom 1.27: PI.1 6.35,48.26 D1.A
VCCS
  Top 1.27: R3.2 24.13,38.1 C4.+
  Bottom 1.27: IC2.8 30.48,38.1 24.13,38.1 C4.+ | R22.2 R23.2 R24.2 R25.2 50.8,54.61 22.86,54.61 | 22.86,54.61 IC1.14 | 21.59,54.61 JP1.2 C1.+ | 21.59,54.61 22.86,54.61 | R3.2 21.59,48.26 21.59,54.61
VDDA
  Top 1.27: D4.C 81.28,72.39 AO.4
VE
  Top 0.635: R3.1 IC1.5 35.56,30.48 IC2.3
  Bottom 0.635: IC1.1 29.21,45.72 R3.1
VGND
  Top 0.635: JP5.2 91.44,67.31 91.44,50.8 93.98,48.26 R49.2 | IC4.5 78.74,57.15 IC4.3
  Bottom 0.635: R49.2 95.25,49.53 88.9,49.53 | 88.9,49.53 81.28,49.53 IC4.3 | IC5.5 85.09,22.86 86.36,22.86 88.9,25.4 88.9,49.53

### Text on the board
tPlace: Yantronix ECG v1.0 | YANTRONIX